# EasyEDA schematic SCH_Endurance_drone_1.json
TITLE: Drone main PCB; REV: 1.0; Date: 2021-08-20; Sheet: 1/1; Company: Endurance
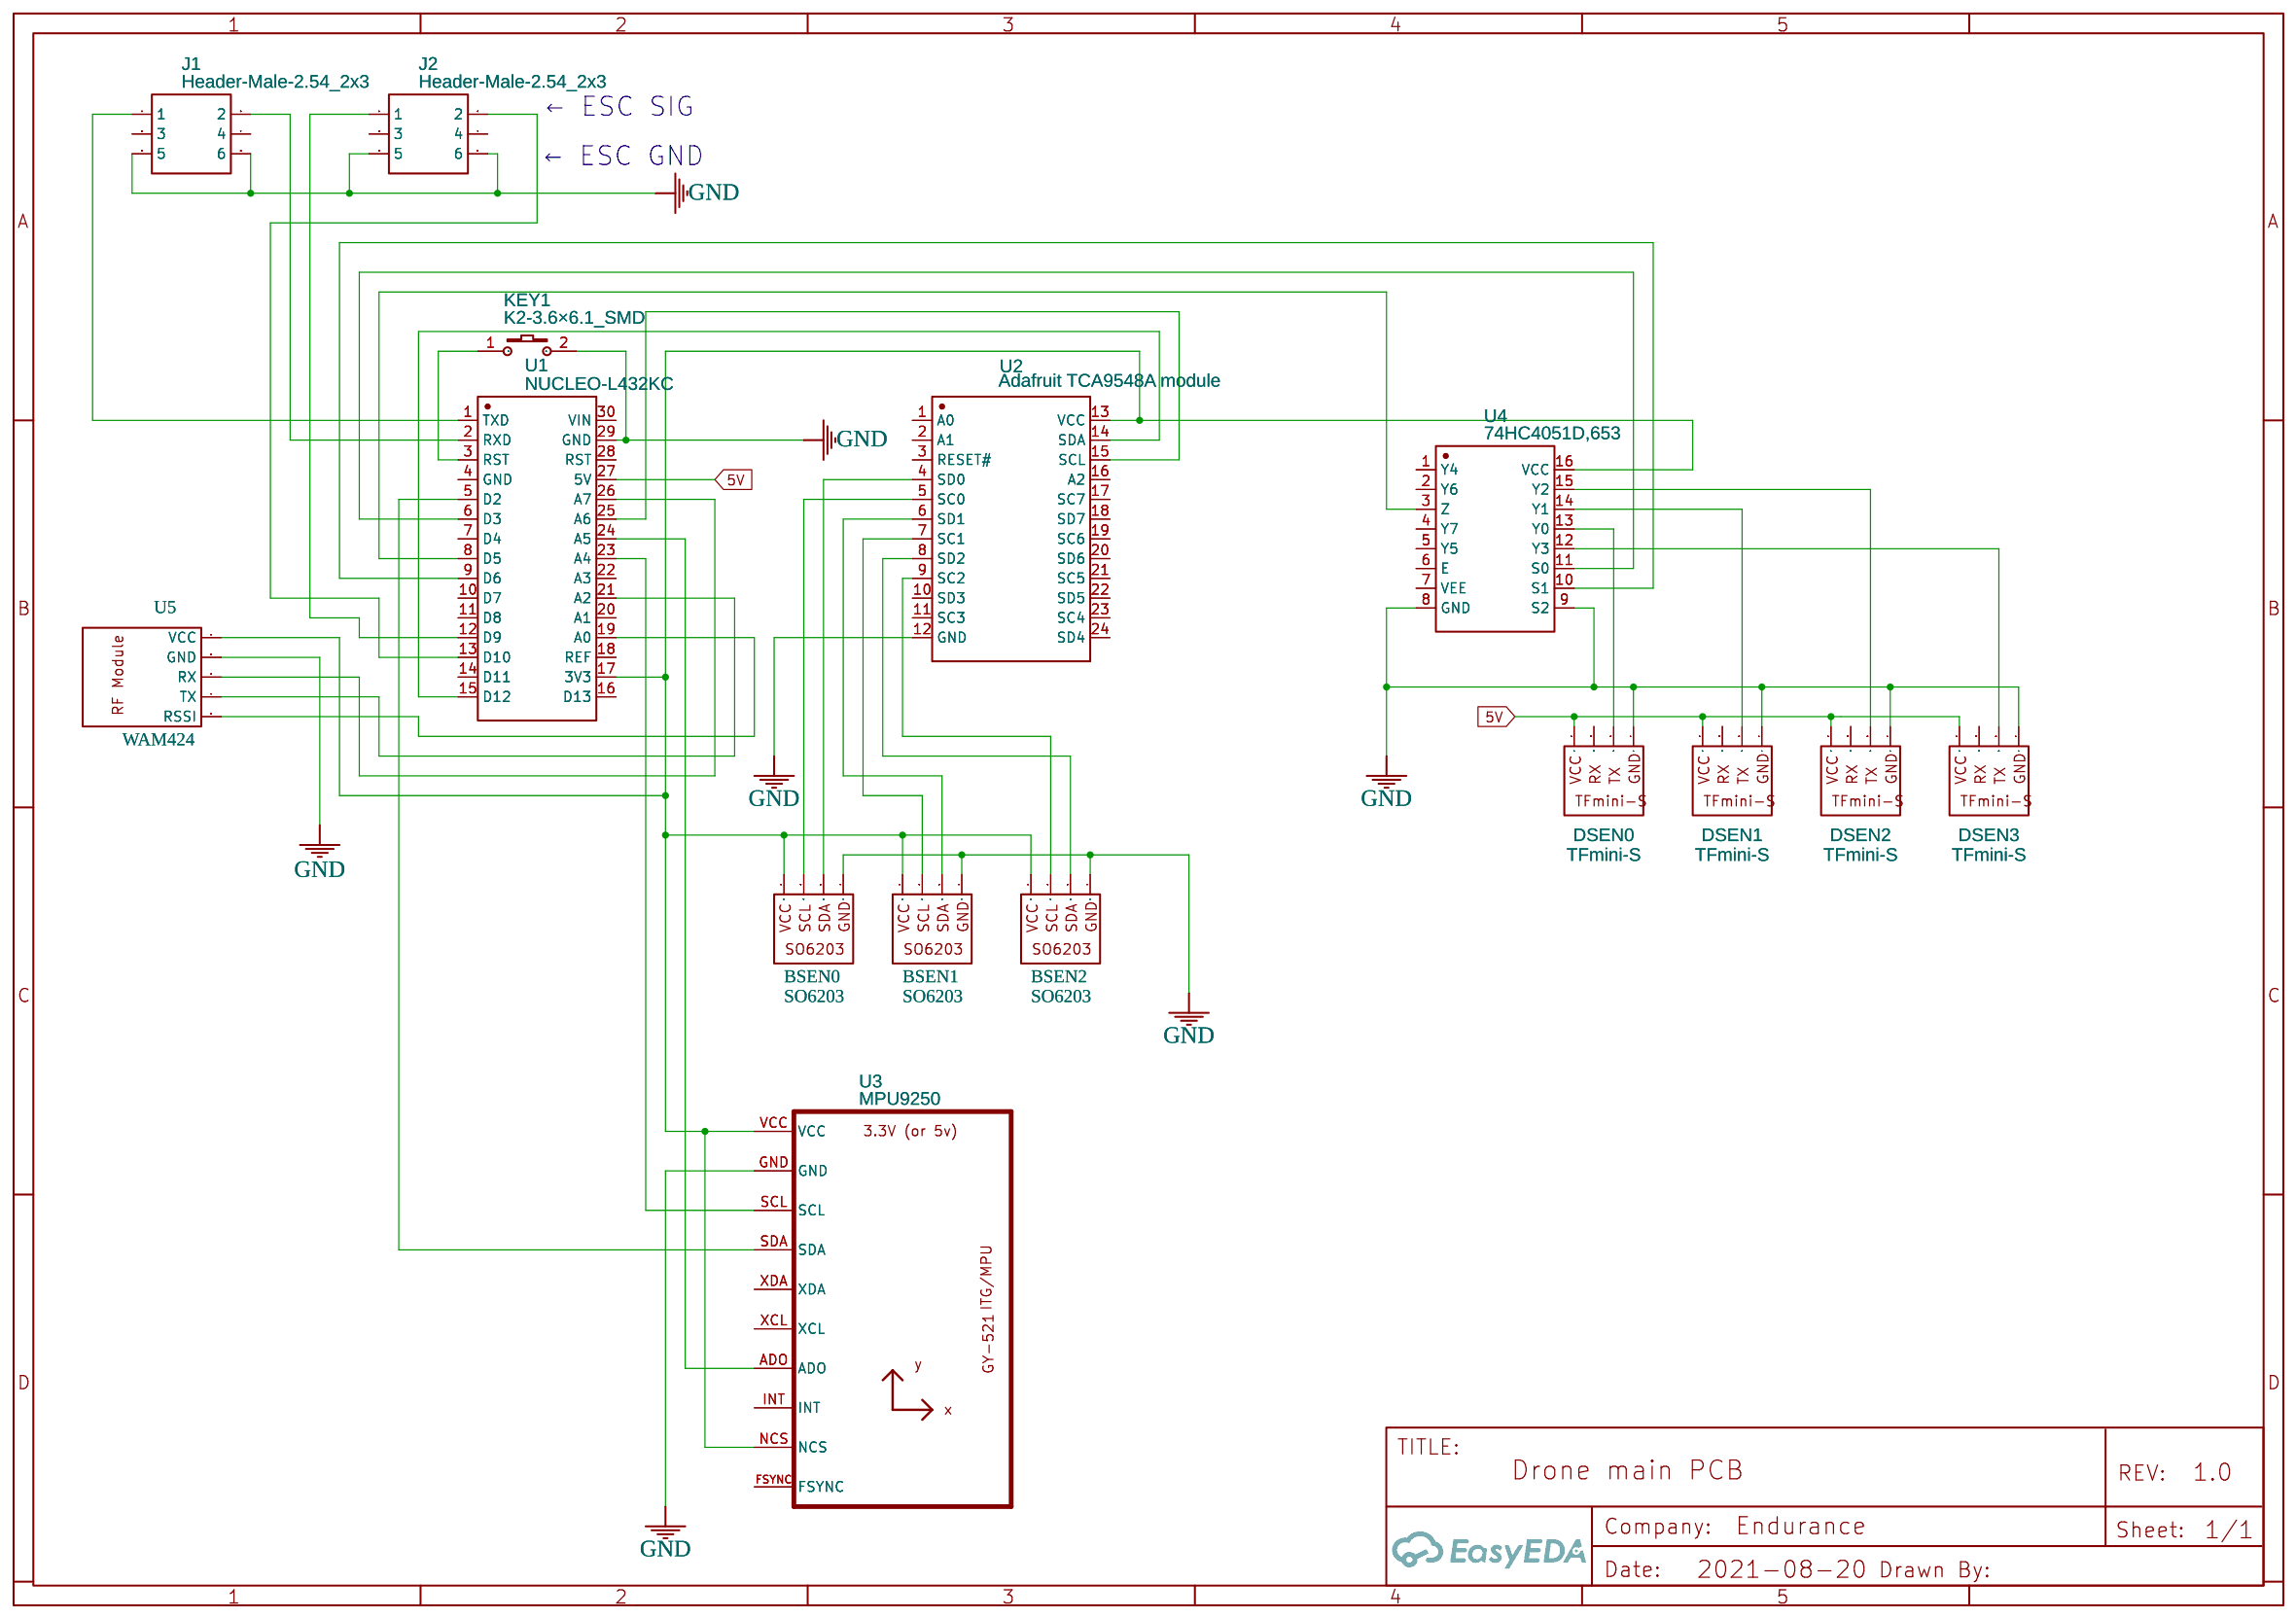
[diagram p0: schematic sheet]

## Parts
BSEN0  SO6203  [PIN_HEADER]
BSEN1  SO6203  [PIN_HEADER]
BSEN2  SO6203  [PIN_HEADER]
DSEN0  TFmini-S  [PIN_HEADER]
DSEN1  TFmini-S  [PIN_HEADER]
DSEN2  TFmini-S  [PIN_HEADER]
DSEN3  TFmini-S  [PIN_HEADER]
J1  Header-Male-2.54_2x3  [HDR-TH_6P-P2.54-V-M-R2-C3-S2.54-1]
J2  Header-Male-2.54_2x3  [HDR-TH_6P-P2.54-V-M-R2-C3-S2.54-1]
KEY1  K2-3.6×6.1_SMD  [KEY-SMD_2P-L6.2-W3.6-LS8.0]
SEN0  SO6203
SEN1  SO6203
SEN2  SO6203
SEN3  TFmini-S
SEN4  TFmini-S
SEN5  TFmini-S
SEN6  TFmini-S
U1  NUCLEO-L432KC  [DIP-30_L51.0-W17.8-P2.54-LS15.2-TL]
U2  Adafruit TCA9548A module  [TCA9548A]
U3  MPU9250  [GY-521]
U4  74HC4051D,653  [SOIC-16_L9.9-W3.9-P1.27-LS6.0-BL]
U5  WAM424  [PIN_HEADER_5]

## Library data of the parts
J1 J2 = Header-Male-2.54_2x3: Supplier: LCSC; Manufacturer: BOOMELE; Supplier Part: C65114; JLCPCB Part Class: Extended Part
KEY1 = K2-3.6×6.1_SMD: Supplier Part: C118141; Supplier: LCSC; Manufacturer Part: K2-1107ST-A4SW-06; Contributor: LCEDA_Lib; 制造商: 韩国韩荣
U1 = NUCLEO-L432KC: Supplier: LCSC; Manufacturer: STMicroelectronics; Supplier Part: C94814; JLCPCB Part Class: Extended Part
U2 = TCA9548APWR: Supplier: LCSC; Manufacturer: TI; Supplier Part: C130026; JLCPCB Part Class: Extended Part; Package Display: No
U3 = MPU9250: Contributor: StefMas
U4 = 74HC4051D,653: Supplier: LCSC; Manufacturer: Nexperia; Supplier Part: C9386; JLCPCB Part Class: Extended Part

## Nets
5V: DSEN0.1 DSEN1.1 DSEN2.1 DSEN3.1 U1.27(5V)
GND: BSEN0.4 BSEN1.4 BSEN2.4 DSEN0.4 DSEN1.4 DSEN2.4 DSEN3.4 J1.5 J1.6 J2.5 J2.6 KEY1.2 U1.29(GND) U2.12(GND) U3.GND U4.8(GND) U4.9(S2) U5.2(GND)
Net-(BSEN0-1): BSEN0.1 BSEN1.1 BSEN2.1 U1.17(3V3) U2.13(VCC) U3.NCS U3.VCC U4.16(VCC) U5.1(VCC)
Net-(BSEN0-2): BSEN0.2 U2.5(SC0)
Net-(BSEN0-3): BSEN0.3 U2.4(SD0)
Net-(BSEN1-2): BSEN1.2 U2.7(SC1)
Net-(BSEN1-3): BSEN1.3 U2.6(SD1)
Net-(BSEN2-2): BSEN2.2 U2.9(SC2)
Net-(BSEN2-3): BSEN2.3 U2.8(SD2)
Net-(DSEN0-3): DSEN0.3 U4.13(Y0)
Net-(DSEN1-3): DSEN1.3 U4.14(Y1)
Net-(DSEN2-3): DSEN2.3 U4.15(Y2)
Net-(DSEN3-3): DSEN3.3 U4.12(Y3)
Net-(J1-1): J1.1 U1.1(TXD)
Net-(J1-2): J1.2 U1.2(RXD)
Net-(J2-1): J2.1 U1.12(D9)
Net-(J2-2): J2.2 U1.13(D10)
Net-(KEY1-1): KEY1.1 U1.3(RST)
Net-(U1-5): U1.5(D2) U3.SDA
Net-(U1-6): U1.6(D3) U4.11(S0)
Net-(U1-8): U1.8(D5) U4.3(Z)
Net-(U1-9): U1.9(D6) U4.10(S1)
Net-(U1-15): U1.15(D12) U2.14(SDA)
Net-(U1-19): U1.19(A0) U5.5(RSSI)
Net-(U1-21): U1.21(A2) U5.4(TX)
Net-(U1-23): U1.23(A4) U3.SCL
Net-(U1-24): U1.24(A5) U3.ADO
Net-(U1-25): U1.25(A6) U2.15(SCL)
Net-(U1-26): U1.26(A7) U5.3(RX)

Not connected (* = marked no-connect by the designer): DSEN0 2; DSEN1 2; DSEN2 2; DSEN3 2; J1 3 4; J2 3 4; U1 4(GND) 7(D4) 10(D7) 11(D8) 14(D11) 16(D13) 18(REF) 20(A1) 22(A3) 28(RST) 30(VIN); U2 1(A0) 2(A1) 3(RESET#) 10(SD3) 11(SC3) 16(A2) 17(SC7) 18(SD7) 19(SC6) 20(SD6) 21(SC5) 22(SD5) 23(SC4) 24(SD4); U3 FSYNC INT XCL XDA; U4 1(Y4) 2(Y6) 4(Y7) 5(Y5) 6(E) 7(VEE)

## Notes on the sheet
- ← ESC SIG
- ← ESC GND
- 김정현
